# EAGLE schematic strip10 (EAGLE 8.0.1)
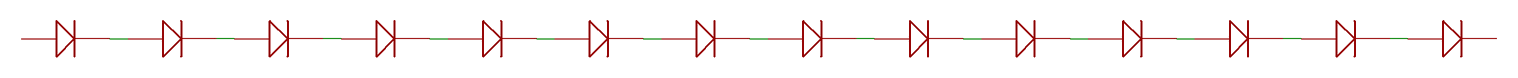
[diagram p0: schematic, sheet 1]

## Parts
U$1  JDSTS2.EM-HRHT-XX52-1  [JDSTS2.EM-HRHT-XX52-1]
U$2  JDSTS2.EM-HRHT-XX52-1  [JDSTS2.EM-HRHT-XX52-1]
U$3  JDSTS2.EM-HRHT-XX52-1  [JDSTS2.EM-HRHT-XX52-1]
U$4  JDSTS2.EM-HRHT-XX52-1  [JDSTS2.EM-HRHT-XX52-1]
U$5  JDSTS2.EM-HRHT-XX52-1  [JDSTS2.EM-HRHT-XX52-1]
U$6  JDSTS2.EM-HRHT-XX52-1  [JDSTS2.EM-HRHT-XX52-1]
U$7  JDSTS2.EM-HRHT-XX52-1  [JDSTS2.EM-HRHT-XX52-1]
U$8  JDSTS2.EM-HRHT-XX52-1  [JDSTS2.EM-HRHT-XX52-1]
U$9  JDSTS2.EM-HRHT-XX52-1  [JDSTS2.EM-HRHT-XX52-1]
U$10  JDSTS2.EM-HRHT-XX52-1  [JDSTS2.EM-HRHT-XX52-1]
U$11  JDSTS2.EM-HRHT-XX52-1  [JDSTS2.EM-HRHT-XX52-1]
U$12  JDSTS2.EM-HRHT-XX52-1  [JDSTS2.EM-HRHT-XX52-1]
U$13  JDSTS2.EM-HRHT-XX52-1  [JDSTS2.EM-HRHT-XX52-1]
U$14  JDSTS2.EM-HRHT-XX52-1  [JDSTS2.EM-HRHT-XX52-1]

## Nets
N$1: U$1.3V U$2.GND
N$2: U$2.3V U$3.GND
N$3: U$3.3V U$4.GND
N$4: U$4.3V U$5.GND
N$5: U$5.3V U$6.GND
N$6: U$6.3V U$7.GND
N$7: U$7.3V U$8.GND
N$8: U$8.3V U$9.GND
N$9: U$9.3V U$10.GND
N$10: U$10.3V U$11.GND
N$11: U$11.3V U$12.GND
N$12: U$13.3V U$14.GND
N$13: U$12.3V U$13.GND
Unconnected: U$1.GND U$14.3V

## Library data of the parts
U$1-U$14 = Smile_Shade:JDSTS2.EM-HRHT-XX52-1